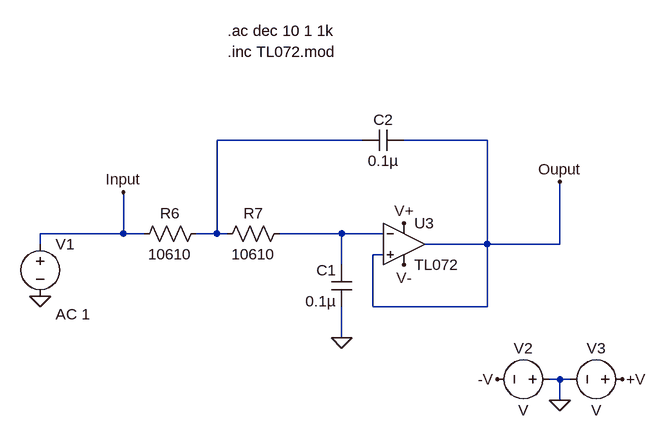
[diagram p0: schematic Sallen Key Low Pass.asc]
Sallen Key Low Pass.asc, the LTspice schematic file:
Version 4
SHEET 1 1044 680
WIRE 592 -80 368 -80
WIRE 784 -80 656 -80
WIRE 224 64 224 0
WIRE 224 64 96 64
WIRE 256 64 224 64
WIRE 368 64 368 -80
WIRE 368 64 336 64
WIRE 384 64 368 64
WIRE 560 64 464 64
WIRE 624 64 560 64
WIRE 96 80 96 64
WIRE 784 80 784 -80
WIRE 784 80 688 80
WIRE 896 80 896 -16
WIRE 896 80 784 80
WIRE 624 96 608 96
WIRE 560 112 560 64
WIRE 608 176 608 96
WIRE 784 176 784 80
WIRE 784 176 608 176
WIRE 560 224 560 176
WIRE 896 288 880 288
WIRE 912 288 896 288
WIRE 896 320 896 288
FLAG 560 224 0
FLAG 224 0 Input
FLAG 896 -16 Ouput
FLAG 96 160 0
FLAG 896 320 0
FLAG 800 288 -V
FLAG 992 288 +V
FLAG 656 48 V+
FLAG 656 112 V-
SYMBOL res 352 48 R90
WINDOW 0 0 56 VBottom 2
WINDOW 3 32 56 VTop 2
SYMATTR InstName R6
SYMATTR Value 10610
SYMBOL res 480 48 R90
WINDOW 0 0 56 VBottom 2
WINDOW 3 32 56 VTop 2
SYMATTR InstName R7
SYMATTR Value 10610
SYMBOL cap 576 176 R180
WINDOW 0 24 56 Left 2
WINDOW 3 24 8 Left 2
SYMATTR InstName C1
SYMATTR Value 0.1µ
SYMBOL cap 592 -64 R270
WINDOW 0 32 32 VTop 2
WINDOW 3 0 32 VBottom 2
SYMATTR InstName C2
SYMATTR Value 0.1µ
SYMBOL Opamps\\opamp2 656 16 R0
SYMATTR InstName U3
SYMATTR Value TL072
SYMBOL voltage 96 64 R0
WINDOW 123 24 124 Left 2
WINDOW 39 0 0 Left 0
SYMATTR Value2 AC 1
SYMATTR InstName V1
SYMATTR Value ""
SYMBOL voltage 896 288 R90
WINDOW 0 -32 56 VBottom 2
WINDOW 3 32 56 VTop 2
SYMATTR InstName V2
SYMBOL voltage 1008 288 R90
WINDOW 0 -32 56 VBottom 2
WINDOW 3 32 56 VTop 2
SYMATTR InstName V3
TEXT 384 -248 Left 2 !.ac dec 10 1 1k
TEXT 384 -216 Left 2 !.inc TL072.mod

The netlist it stands for:
* Sallen Key Low Pass.asc
R6 N001 Input 10610
R7 N002 N001 10610
C1 0 N002 0.1µ
C2 N001 Ouput 0.1µ
XU3 Ouput N002 V+ V- Ouput TL072  ; pins In+ In- V+ V- OUT
V1 Input 0 AC 1
V2 0 -V V
V3 +V 0 V
.ac dec 10 1 1k
.inc TL072.mod
.backanno
.end